# Altium project gas_gauge_smol.PrjPCB
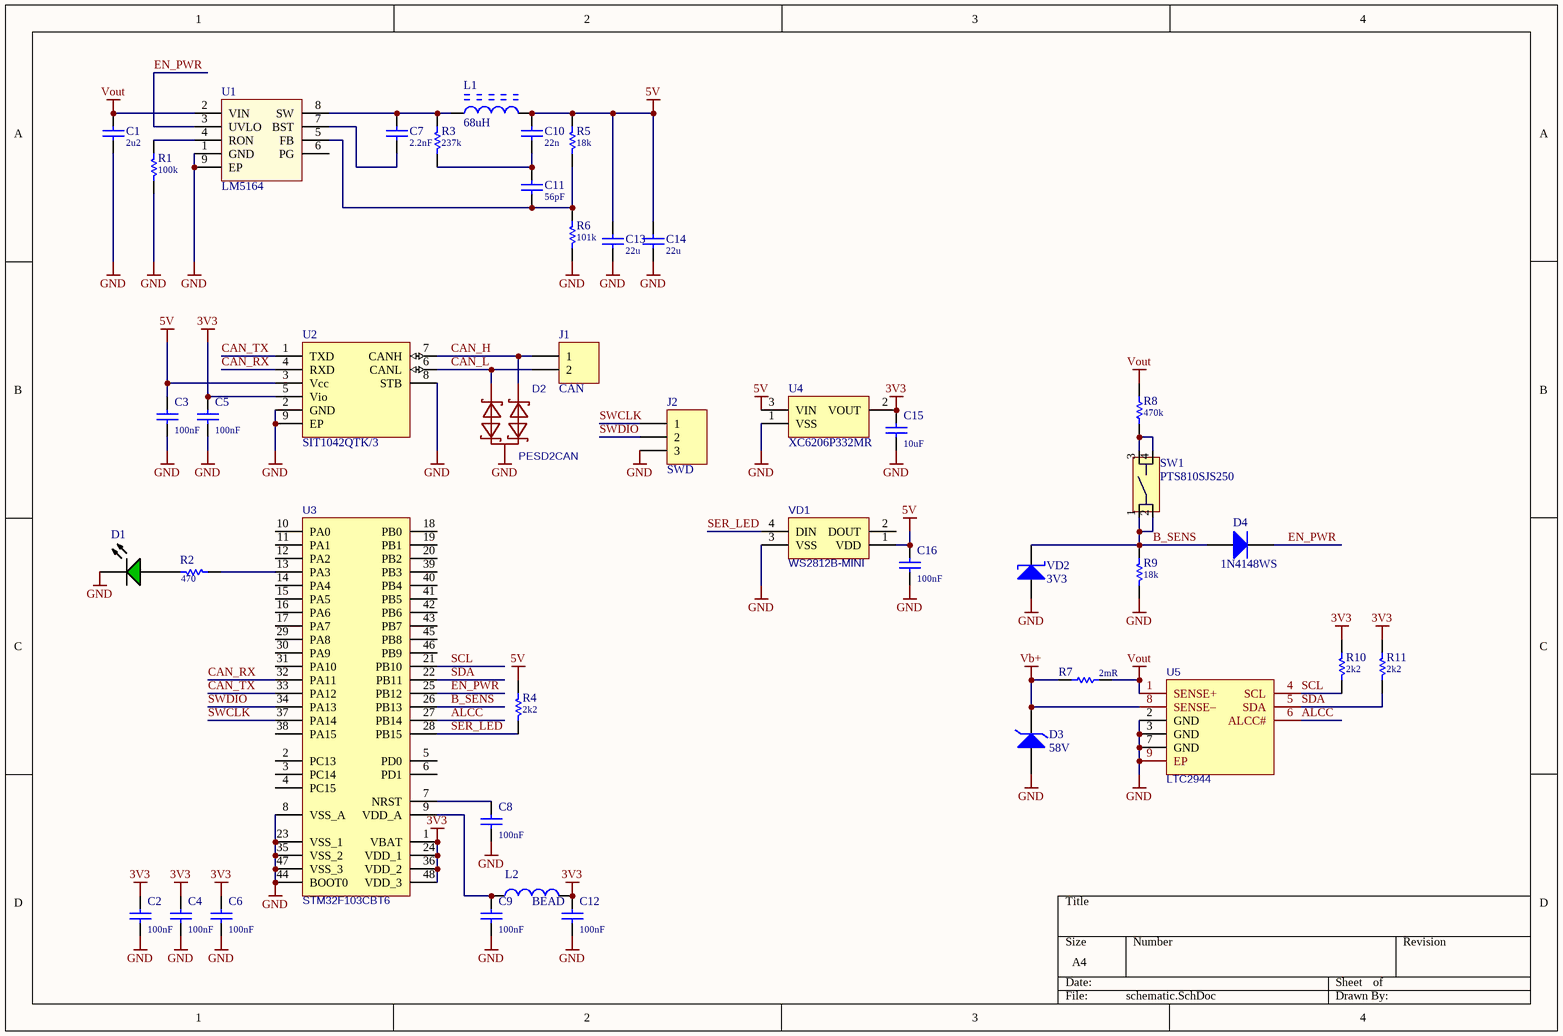
[diagram p0: schematic.SchDoc]
PRJ_ID: EBC GG Smol; PRJ_VER: v1.0.0
1 sheet, 43 parts. Net scope: global (net labels, ports and power ports of the same name join across sheets).
Board file: board.PcbDoc

## Sheet schematic.SchDoc
size A4; SheetNumber: 6; SheetTotal: 29

### Parts
C1  2u2  [C1210]
C2  100nF  [C0402]
C3  100nF  [C0402]
C4  100nF  [C0402]
C5  100nF  [C0402]
C6  100nF  [C0402]
C7  2.2nF  [C0603]
C8  100nF  [C0402]
C9  100nF  [C0402]
C10  22n  [C0603]
C11  56pF  [C0603]
C12  100nF  [C0402]
C13  22u  [C1210]
C14  22u  [C1210]
C15  10uF  [C0603]
C16  100nF  [C0402]
D1  GRN  [LED-0603-GRN]  (value not drawn)
D2  PESD2CAN  [SOT-23]
D3  58V  [SMA]
D4  1N4148WS  [SOD-323]
J1  CAN  [HDR-1X2]  (no BOM)
J2  SWD  [HDR-1x3-P1.25]  (no BOM)
L1  68uH  [L0605-POWER]
L2  BEAD  [L0402]
R1  100k  [R0603]
R2  470  [R0402]
R3  237k  [R0603]
R4  2k2  [R0402]
R5  18k  [R0603]
R6  101k  [R0603]
R7  2mR  [R2512-WIDE]
R8  470k  [R1206]
R9  18k  [R0603]
R10  2k2  [R0402]
R11  2k2  [R0402]
SW1  PTS810SJS250  [BTN_PTS810]
U1  LM5164  [PowerSOIC-8]
U2  SIT1042QTK/3  [DFN8_3X3_P065]
U3  STM32F103CBT6  [LQFP-48]
U4  XC6206P332MR  [SOT-23]
U5  LTC2944  [DFN8_3X3_P05]
VD1  WS2812B-MINI  [LED-SMD_4P-L3.5-W3.5-TL_WS2812B]
VD2  3V3  [SOD-123]

### Nets
3V3: C2.2 C4.2 C5.2 C6.2 C12.2 C15.2 L2.1 R10.2 R11.2 U2.5(Vio) U3.1(VBAT) U3.24(VDD_1) U3.36(VDD_2) U3.48(VDD_3) U4.2(VOUT)
5V: C3.2 C10.2 C13.2 C14.2 C16.2 L1.2 R4.2 R5.1 U2.3(Vcc) U4.3(VIN) VD1.1(VDD)
GND: C1.1 C2.1 C3.1 C4.1 C5.1 C6.1 C8.1 C9.1 C12.1 C13.1 C14.1 C15.1 C16.1 D1.2(K) D2.3 D3.1(-) J2.3 R1.2 R6.2 R9.1 U1.1(GND) U1.9(EP) U2.2(GND) U2.8(STB) U2.9(EP) U3.8(VSS_A) U3.23(VSS_1) U3.35(VSS_2) U3.44(BOOT0) U3.47(VSS_3) U4.1(VSS) U5.2(GND) U5.3(GND) U5.7(GND) U5.9(EP) VD1.3(VSS) VD2.1(A)
Vb+: D3.2(+) R7.1 U5.8(SENSE–)
Vout: C1.2 R7.2 R8.1 U1.2(VIN) U5.1(SENSE+)
ALCC: U3.27(PB14) U5.6(ALCC#)
B_SENS: D4.1(A) R9.2 SW1.1 SW1.2 U3.26(PB13) VD2.2(C)
CAN_H: D2.2 J1.1 U2.7(CANH)
CAN_L: D2.1 J1.2 U2.6(CANL)
CAN_RX: U2.4(RXD) U3.32(PA11)
CAN_TX: U2.1(TXD) U3.33(PA12)
EN_PWR: D4.2(K) U1.3(UVLO) U3.25(PB12)
SCL: R10.1 U3.21(PB10) U5.4(SCL)
SDA: R11.1 U3.22(PB11) U5.5(SDA)
SER_LED: R4.1 U3.28(PB15) VD1.4(DIN)
SWCLK: J2.1 U3.37(PA14)
SWDIO: J2.2 U3.34(PA13)
NetC7_1: C7.1 U1.7(BST)
NetC7_2: C7.2 L1.1 R3.1 U1.8(SW)
NetC8_2: C8.2 U3.7(NRST)
NetC9_2: C9.2 L2.2 U3.9(VDD_A)
NetC10_1: C10.1 C11.2 R3.2
NetC11_1: C11.1 R5.2 R6.1 U1.5(FB)
NetD1_1: D1.1(A) R2.1
NetR1_1: R1.1 U1.4(RON)
NetR2_2: R2.2 U3.13(PA3)
NetR8_2: R8.2 SW1.3 SW1.4

Not connected (* = marked no-connect by the designer): U1 6(PG); U3 2(PC13) 3(PC14) 4(PC15) 5(PD0) 6(PD1) 10(PA0) 11(PA1) 12(PA2) 14(PA4) 15(PA5) 16(PA6) 17(PA7) 18(PB0) 19(PB1) 20(PB2) 29(PA8) 30(PA9) 31(PA10) 38(PA15) 39(PB3) 40(PB4) 41(PB5) 42(PB6) 43(PB7) 45(PB8) 46(PB9); VD1 2(DOUT)

### Library data of the parts
C1 = CAP: 2.2uF 100V 1210
C2-C6 C8 C9 C12 = CAP: 100nF 50V 0402
C7 = CAP: 2.2nF 50V 0603
C10 = CAP: 2.2nF 0603
C11 = CAP: 56pF 0603
C13 C14 = CAP: 22u 35V 1210
C15 = CAP: 10uf 50V 1206
C16 = CAP: 100nF 50V 0402; P/N: CC0402KRX7R9BB104; LCSC part number: C131394
D1 = LED-0603-GREEN: LED 0603 GRN
D2 = CDSOT23-SM712: LCSC part number: C5261081; P/N: PESD2CAN
D3 = NCP51460SN33T1G: SMAJ58A; P/N: SMCJ24A; LCSC part number: C693617
D4 = US1M-13-F
J1 = Header 2
J2 = Header 3
L1 = SRN3015-100M: PSPMAA0605H-680M-IGF
L2 = BLM18AG601SN1D: BEAD 0402
R1 = RES: 100k 0603
R2 R4 R10 R11 = RES
R3 = RES: 237k 0603
R5 R9 = RES: 18k 0603
R6 = RES: 101k 0603
R7 = RES: 2mR shunt 2512; P/N: PA2512FKF7T0R002E; LCSC part number: C728320
R8 = RES: 470k 1206
SW1 = Component_1
U2 = LTC2875: IC INTERFACE CAN
U4 = Component_4_1
U5 = LTC2944IDD#TRPBF: LCSC part number: C683673; P/N: LTC2944IDD#TRPBF
VD2 = ZENER: Zener 3.3V
VD1 = WS2812B-MINI: LCSC part number: C527089; P/N: WS2812B-Mini